# Altium schematic sheet Interface.SchDoc
size A4
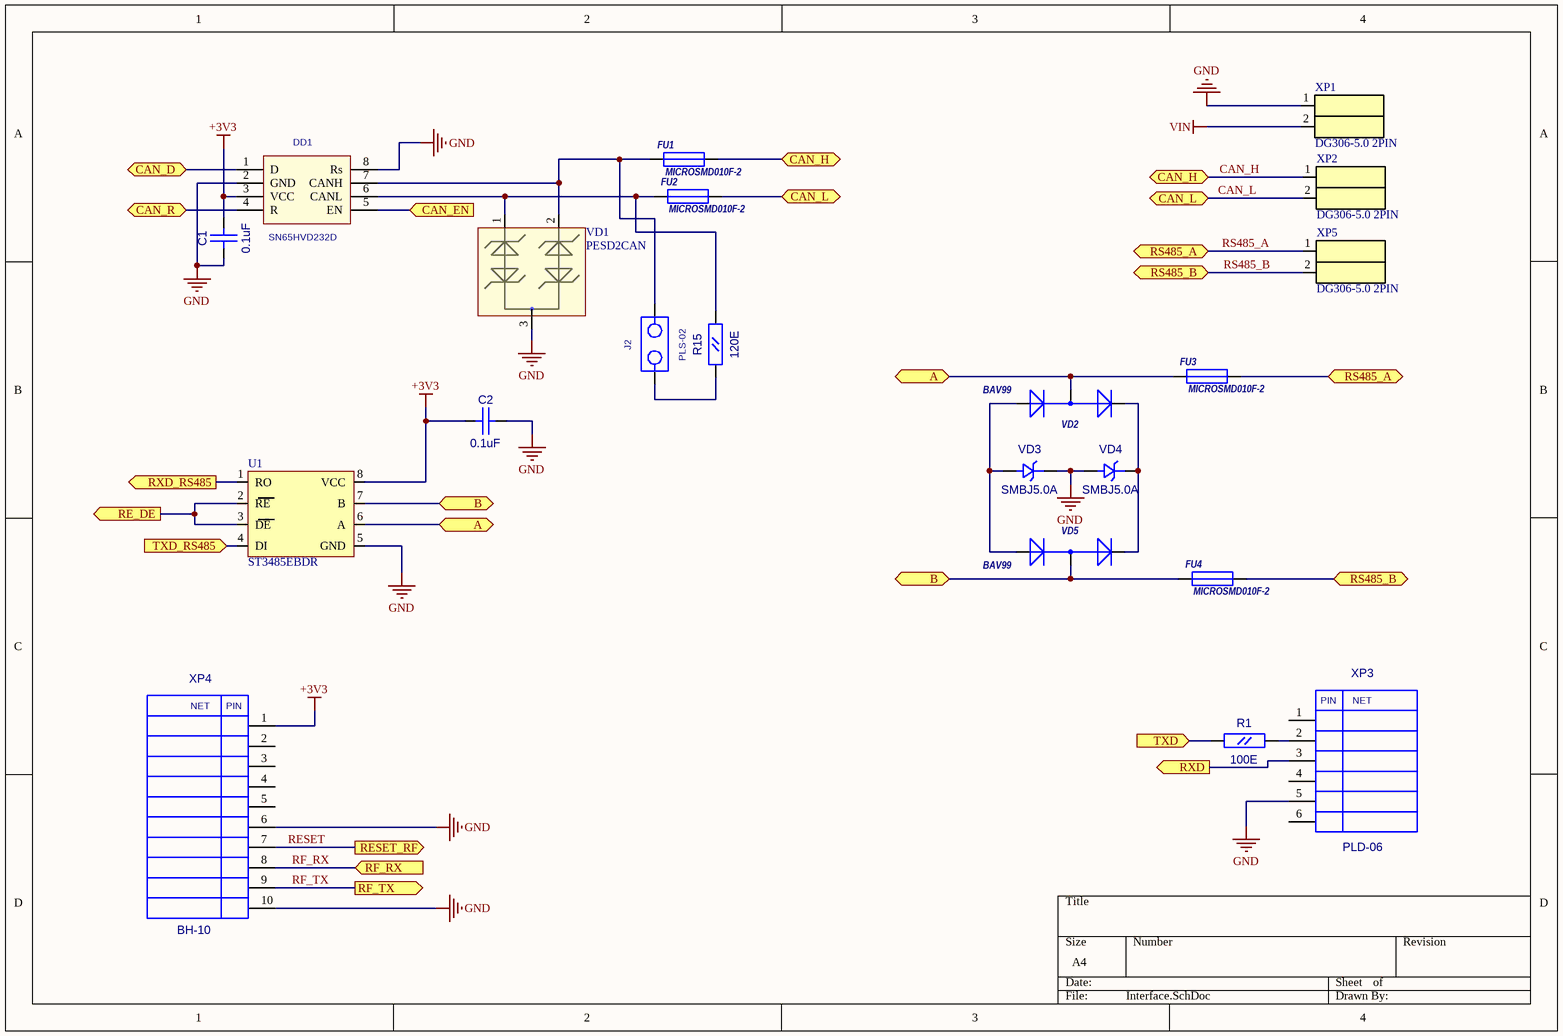
[diagram p0: Interface.SchDoc]

## Parts
C1  0.1uF  [CC0603]
C2  0.1uF  [CC0603]
DD1  SN65HVD232D  [SO-8]
FU1  MICROSMD010F-2  [RC1210]
FU2  MICROSMD010F-2  [RC1210]
FU3  MICROSMD010F-2  [RC1210]
FU4  MICROSMD010F-2  [RC1210]
J2  PLS-02  [PLS-02]
R1  100E  [RC0603]
R15  120E  [RC0805]
U1  ST3485EBDR  [SO-8]
VD1  PESD2CAN  [SOT-23(123)]
VD2  BAV99  [SOT-23(GSD)]
VD3  SMBJ5.0A  [SMB]
VD4  SMBJ5.0A  [SMB]
VD5  BAV99  [SOT-23(GSD)]
XP1  DG306-5.0 2PIN  [DG306-5.0]
XP2  DG306-5.0 2PIN  [DG306-5.0]
XP3  PLD-06  [PIN6]
XP4  BH-10  [BH-10]
XP5  DG306-5.0 2PIN  [DG306-5.0]

## Ports
A (bidir), B (bidir), CAN_D, CAN_EN (in), CAN_H, CAN_L, CAN_R, RE_DE (out), RESET_RF (out), RF_RX (in), RF_TX (out), RS485_A, RS485_B, RXD (out), RXD_RS485 (out), TXD (in), TXD_RS485 (in)

## Nets
+3V3: C1.2(B) C2.1(A) DD1.3(VCC) U1.8(VCC) XP4.1
GND: C1.1(A) C2.2(B) DD1.2(GND) DD1.8(Rs) U1.5(GND) VD1.3 VD3.2(K) VD4.1(A) XP1.1 XP3.5 XP4.6 XP4.10
VIN: XP1.2
A: FU3.1 U1.6(A) VD2.3(AK) ; port A
B: FU4.1 U1.7(B) VD5.3(AK) ; port B
CAN_D: DD1.1(D) ; port CAN_D
CAN_EN: DD1.5(EN) ; port CAN_EN
CAN_H: FU1.2 XP2.1 ; port CAN_H
CAN_L: FU2.2 XP2.2 ; port CAN_L
CAN_R: DD1.4(R) ; port CAN_R
RE_DE: U1.2(RE) U1.3(DE) ; port RE_DE
RESET: XP4.7 ; port RESET_RF
RF_RX: XP4.8 ; port RF_RX
RF_TX: XP4.9 ; port RF_TX
RS485_A: FU3.2 XP5.1 ; port RS485_A
RS485_B: FU4.2 XP5.2 ; port RS485_B
RXD: XP3.3 ; port RXD
RXD_RS485: U1.1(RO) ; port RXD_RS485
TXD: R1.1(A) ; port TXD
TXD_RS485: U1.4(DI) ; port TXD_RS485
NetDD1_6: DD1.6(CANL) FU2.1 R15.2(B) VD1.1
NetDD1_7: DD1.7(CANH) FU1.1 J2.2 VD1.2
NetJ2_1: J2.1 R15.1(A)
NetR1_2: R1.2(B) XP3.2
NetVD2_1: VD2.1(A) VD3.1(A) VD5.1(A)
NetVD2_2: VD2.2(K) VD4.2(K) VD5.2(K)

Not connected (* = marked no-connect by the designer): XP3 1 4 6; XP4 2 3 4 5

## Notes on the sheet
- (in symbol BH-10) NET; PIN
- (in symbol PLD-06) PIN; NET

## Library data of the parts
C1 C2 = CC0603: Value: 0.1uF
DD1 = SN65HVD234D: CAN Transceiver; Value: *
FU1-FU4 = MICROSMD: Value: MICROSMD010F-2
R1 = RC0603: Value: 100E
R15 = RC0805: Value: 120E
VD1 = PESD2CAN: TVS for CAN
VD2 VD5 = BAV99: 1.0 Ampere General Purpose Rectifier; ComponentField6: Published 8-Jun-2000, Modified 11-July-2000: SIM Model Added.; Value: *
VD3 VD4 = SMBJ: Value: SMBJ5.0A
XP3 = PLD-06: PLD06; Value: *
J2 = PLS-02: Value: *
U1 = ST3485EBDR: Value: ST3485EBDR
XP1 XP2 XP5 = DG306-5.0 2PIN: Value: DG306-5.0 2PIN
XP4 = BH-10: Value: *